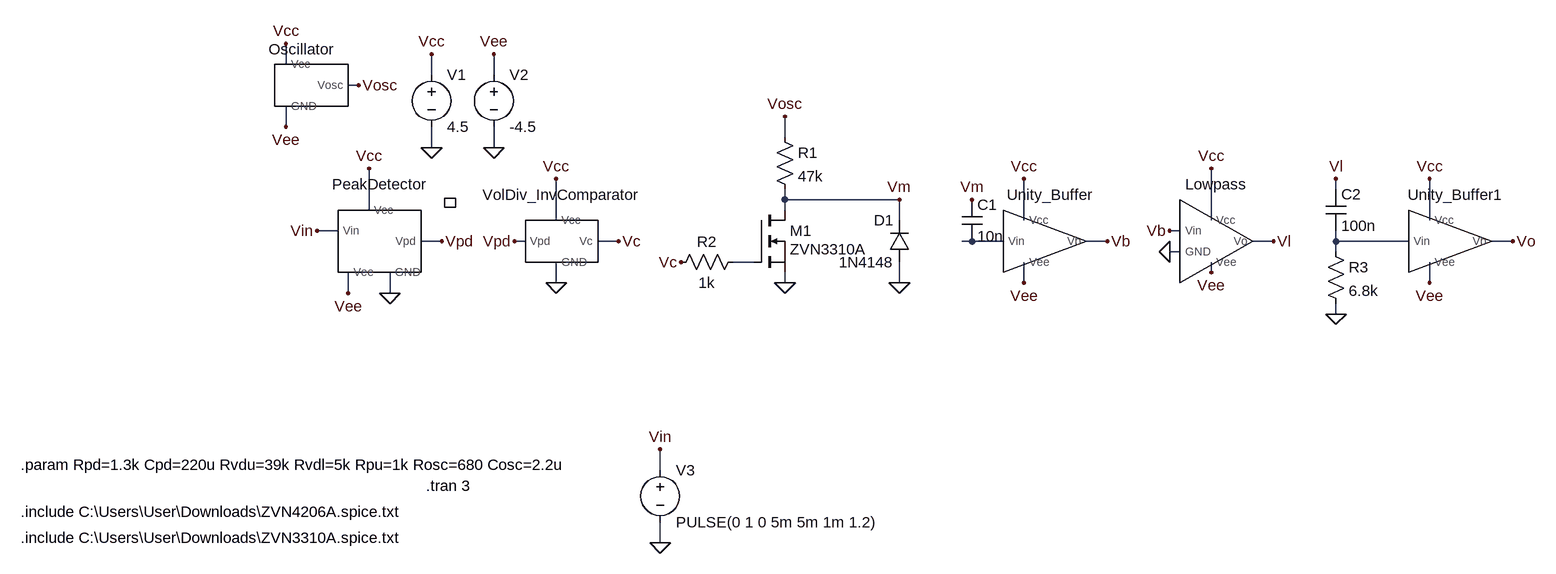
[diagram p0: schematic lab6.asc]
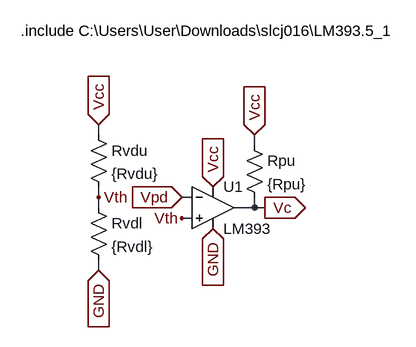
[diagram p1: sub-circuit voldiv_invcomp.asc]
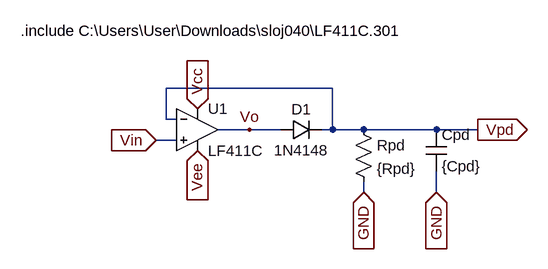
[diagram p2: sub-circuit peak_detector.asc]
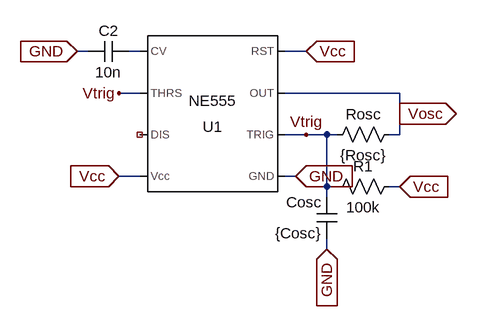
[diagram p3: sub-circuit oscillator.asc]
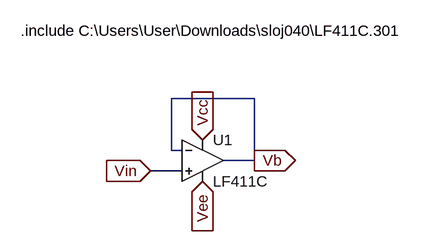
[diagram p4: sub-circuit unity_buffer.asc]
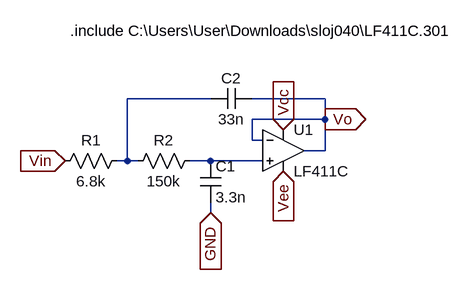
[diagram p5: sub-circuit lowpass.asc]
lab6.asc, the LTspice schematic file:
Version 4
SHEET 1 1960 692
WIRE -48 -96 -48 -128
WIRE 176 -80 176 -112
WIRE 272 -80 272 -112
WIRE 64 -64 48 -64
WIRE -48 0 -48 -32
WIRE 720 16 720 -16
WIRE 176 32 176 0
WIRE 272 32 272 0
WIRE 1568 96 1568 80
WIRE 720 112 720 96
WIRE 896 112 720 112
WIRE 80 128 80 64
WIRE 720 128 720 112
WIRE 368 144 368 80
WIRE 896 144 896 112
WIRE 1088 144 1088 80
WIRE 1376 144 1376 64
WIRE 1712 144 1712 80
WIRE 32 160 0 160
WIRE 1328 160 1312 160
WIRE 192 176 160 176
WIRE 320 176 304 176
WIRE 464 176 432 176
WIRE 1008 176 992 176
WIRE 1056 176 1008 176
WIRE 1216 176 1184 176
WIRE 1472 176 1440 176
WIRE 1568 176 1568 160
WIRE 1680 176 1568 176
WIRE 1840 176 1808 176
WIRE 1328 192 1312 192
WIRE 1568 192 1568 176
WIRE 672 208 640 208
WIRE 1376 224 1376 208
WIRE 368 240 368 208
WIRE 720 240 720 224
WIRE 896 240 896 208
WIRE 1088 240 1088 208
WIRE 1712 240 1712 208
WIRE 48 256 48 224
WIRE 112 256 112 224
WIRE 1568 288 1568 272
WIRE 528 528 528 496
WIRE 528 640 528 608
FLAG 528 640 0
FLAG 176 32 0
FLAG 272 32 0
FLAG 176 -112 Vcc
FLAG 272 -112 Vee
FLAG 528 496 Vin
FLAG 0 160 Vin
FLAG 192 176 Vpd
FLAG 368 240 0
FLAG 368 80 Vcc
FLAG 304 176 Vpd
FLAG 80 64 Vcc
FLAG 48 256 Vee
FLAG 112 256 0
FLAG -48 -128 Vcc
FLAG 64 -64 Vosc
FLAG 464 176 Vc
FLAG 720 240 0
FLAG 720 -16 Vosc
FLAG 1008 112 Vm
FLAG 1088 80 Vcc
FLAG 1088 240 Vee
FLAG 1216 176 Vb
FLAG 1312 160 Vb
FLAG 1376 64 Vcc
FLAG 1376 224 Vee
FLAG 1312 192 0
FLAG 1472 176 Vl
FLAG 896 240 0
FLAG 896 112 Vm
FLAG -48 0 Vee
FLAG 1568 288 0
FLAG 1568 80 Vl
FLAG 1712 80 Vcc
FLAG 1712 240 Vee
FLAG 1840 176 Vo
FLAG 560 208 Vc
SYMBOL voltage 176 -96 R0
WINDOW 123 0 0 Left 0
WINDOW 39 0 0 Left 0
SYMATTR InstName V1
SYMATTR Value 4.5
SYMBOL voltage 272 -96 R0
WINDOW 123 0 0 Left 0
WINDOW 39 0 0 Left 0
SYMATTR InstName V2
SYMATTR Value -4.5
SYMBOL voltage 528 512 R0
WINDOW 123 0 0 Left 0
WINDOW 39 0 0 Left 0
SYMATTR InstName V3
SYMATTR Value PULSE(0 1 0 5m 5m 1m 1.2)
SYMBOL VolDiv_InvComp 368 176 R0
SYMATTR InstName VolDiv_InvComparator
SYMBOL peak_detector 96 176 R0
SYMATTR InstName PeakDetector
SYMBOL oscillator -32 -64 R0
SYMATTR InstName Oscillator
SYMBOL nmos 672 128 R0
WINDOW 3 56 60 Left 2
SYMATTR Value ZVN3310A
SYMATTR InstName M1
SYMATTR Prefix X
SYMBOL res 704 0 R0
SYMATTR InstName R1
SYMATTR Value 47k
SYMBOL unity_buffer 1120 176 R0
SYMATTR InstName Unity_Buffer
SYMBOL Lowpass 1376 176 R0
SYMATTR InstName Lowpass
SYMBOL diode 912 208 R180
WINDOW 0 24 64 Left 2
WINDOW 3 24 0 Left 2
SYMATTR InstName D1
SYMATTR Value 1N4148
SYMBOL unity_buffer 1744 176 R0
SYMATTR InstName Unity_Buffer1
SYMBOL cap 1552 96 R0
SYMATTR InstName C2
SYMATTR Value 100n
SYMBOL res 1552 176 R0
SYMATTR InstName R3
SYMATTR Value 6.8k
SYMBOL res 656 192 R90
WINDOW 0 0 56 VBottom 2
WINDOW 3 32 56 VTop 2
SYMATTR InstName R2
SYMATTR Value 1k
SYMBOL cap 992 112 R0
SYMATTR InstName C1
SYMATTR Value 10n
TEXT -456 520 Left 2 !.param Rpd=1.3k Cpd=220u Rvdu=39k Rvdl=5k Rpu=1k Rosc=680 Cosc=2.2u
TEXT 168 552 Left 2 !.tran 3
TEXT -456 592 Left 2 !.include C:\\Users\\User\\Downloads\\ZVN4206A.spice.txt
TEXT -456 632 Left 2 !.include C:\\Users\\User\\Downloads\\ZVN3310A.spice.txt

voldiv_invcomp.asc, the sub-circuit schematic file:
Version 4
SHEET 1 880 680
WIRE -48 96 -48 80
WIRE 192 112 192 96
WIRE -48 192 -48 176
WIRE 96 192 80 192
WIRE -48 208 -48 192
WIRE 192 208 192 192
WIRE 192 208 160 208
WIRE 208 208 192 208
WIRE 96 224 80 224
WIRE -48 304 -48 288
FLAG 128 240 GND
IOPIN 128 240 In
FLAG 128 176 Vcc
IOPIN 128 176 In
FLAG 80 192 Vpd
IOPIN 80 192 In
FLAG 80 224 Vth
FLAG 208 208 Vc
IOPIN 208 208 Out
FLAG -48 304 GND
IOPIN -48 304 In
FLAG -48 80 Vcc
IOPIN -48 80 In
FLAG -48 192 Vth
FLAG 192 96 Vcc
IOPIN 192 96 In
SYMBOL OpAmps\\opamp2 128 144 R0
SYMATTR InstName U1
SYMATTR Value LM393
SYMBOL res -64 192 R0
SYMATTR InstName Rvdl
SYMATTR Value {Rvdl}
SYMBOL res -64 80 R0
SYMATTR InstName Rvdu
SYMATTR Value {Rvdu}
SYMBOL res 176 96 R0
SYMATTR InstName Rpu
SYMATTR Value {Rpu}
TEXT -168 -64 Left 2 !.include C:\\Users\\User\\Downloads\\slcj016\\LM393.5_1

peak_detector.asc, the sub-circuit schematic file:
Version 4
SHEET 1 2072 680
WIRE 336 0 80 0
WIRE 80 48 80 0
WIRE 96 48 80 48
WIRE 208 64 160 64
WIRE 256 64 208 64
WIRE 336 64 336 0
WIRE 336 64 320 64
WIRE 384 64 336 64
WIRE 496 64 384 64
WIRE 560 64 496 64
WIRE 96 80 64 80
WIRE 384 160 384 144
WIRE 496 160 496 128
FLAG 208 64 Vo
FLAG 64 80 Vin
IOPIN 64 80 In
FLAG 128 32 Vcc
IOPIN 128 32 In
FLAG 128 96 Vee
IOPIN 128 96 In
FLAG 560 64 Vpd
IOPIN 560 64 Out
FLAG 384 160 GND
IOPIN 384 160 In
FLAG 496 160 GND
IOPIN 496 160 In
SYMBOL diode 256 80 R270
WINDOW 0 32 32 VTop 2
WINDOW 3 0 32 VBottom 2
SYMATTR InstName D1
SYMATTR Value 1N4148
SYMBOL res 368 48 R0
SYMATTR InstName Rpd
SYMATTR Value {Rpd}
SYMBOL cap 480 64 R0
SYMATTR InstName Cpd
SYMATTR Value {Cpd}
SYMBOL OpAmps\\opamp2 128 0 R0
SYMATTR InstName U1
SYMATTR Value LF411C
TEXT -144 -88 Left 2 !.include C:\\Users\\User\\Downloads\\sloj040\\LF411C.301

oscillator.asc, the sub-circuit schematic file:
Version 4
SHEET 1 880 680
WIRE 64 64 48 64
WIRE 144 64 128 64
WIRE 400 64 368 64
WIRE 144 128 112 128
WIRE 544 128 368 128
WIRE 544 160 544 128
WIRE 400 192 368 192
WIRE 432 192 400 192
WIRE 448 192 432 192
WIRE 544 192 544 160
WIRE 544 192 528 192
WIRE 144 256 112 256
WIRE 384 256 368 256
WIRE 432 272 432 192
WIRE 448 272 432 272
WIRE 544 272 528 272
WIRE 432 288 432 272
WIRE 432 368 432 352
FLAG 400 64 Vcc
IOPIN 400 64 In
FLAG 112 256 Vcc
IOPIN 112 256 In
FLAG 544 160 Vosc
IOPIN 544 160 Out
FLAG 544 272 Vcc
IOPIN 544 272 In
FLAG 400 192 Vtrig
FLAG 384 256 GND
IOPIN 384 256 In
FLAG 432 368 GND
IOPIN 432 368 In
FLAG 112 128 Vtrig
FLAG 48 64 GND
IOPIN 48 64 In
SYMBOL Misc\\NE555 256 160 R180
SYMATTR InstName U1
SYMBOL res 544 256 R90
WINDOW 0 0 56 VBottom 2
WINDOW 3 32 56 VTop 2
SYMATTR InstName R1
SYMATTR Value 100k
SYMBOL res 544 176 R90
WINDOW 0 0 56 VBottom 2
WINDOW 3 32 56 VTop 2
SYMATTR InstName Rosc
SYMATTR Value {Rosc}
SYMBOL cap 448 352 R180
WINDOW 0 24 56 Left 2
WINDOW 3 24 8 Left 2
SYMATTR InstName Cosc
SYMATTR Value {Cosc}
SYMBOL cap 128 48 R90
WINDOW 0 0 32 VBottom 2
WINDOW 3 32 32 VTop 2
SYMATTR InstName C2
SYMATTR Value 10n

unity_buffer.asc, the sub-circuit schematic file:
Version 4
SHEET 1 880 680
WIRE 256 80 128 80
WIRE 128 160 128 80
WIRE 144 160 128 160
WIRE 256 176 256 80
WIRE 256 176 208 176
WIRE 144 192 96 192
FLAG 176 144 Vcc
IOPIN 176 144 In
FLAG 176 208 Vee
IOPIN 176 208 In
FLAG 96 192 Vin
IOPIN 96 192 In
FLAG 256 176 Vb
IOPIN 256 176 Out
SYMBOL OpAmps\\opamp2 176 112 R0
SYMATTR InstName U1
SYMATTR Value LF411C
TEXT -104 -24 Left 2 !.include C:\\Users\\User\\Downloads\\sloj040\\LF411C.301

lowpass.asc, the sub-circuit schematic file:
Version 4
SHEET 1 880 680
WIRE 144 64 16 64
WIRE 320 64 208 64
WIRE 320 96 320 64
WIRE 320 96 208 96
WIRE 208 128 208 96
WIRE 224 128 208 128
WIRE 320 144 320 96
WIRE 320 144 288 144
WIRE 16 160 16 64
WIRE 16 160 0 160
WIRE 32 160 16 160
WIRE 144 160 112 160
WIRE 224 160 144 160
WIRE 144 240 144 224
FLAG -80 160 Vin
IOPIN -80 160 In
FLAG 256 112 Vcc
IOPIN 256 112 In
FLAG 256 176 Vee
IOPIN 256 176 In
FLAG 320 96 Vo
IOPIN 320 96 Out
FLAG 144 240 GND
IOPIN 144 240 In
SYMBOL res 16 144 R90
WINDOW 0 0 56 VBottom 2
WINDOW 3 32 56 VTop 2
SYMATTR InstName R1
SYMATTR Value 6.8k
SYMBOL res 128 144 R90
WINDOW 0 0 56 VBottom 2
WINDOW 3 32 56 VTop 2
SYMATTR InstName R2
SYMATTR Value 150k
SYMBOL cap 128 160 R0
SYMATTR InstName C1
SYMATTR Value 3.3n
SYMBOL cap 208 48 R90
WINDOW 0 0 32 VBottom 2
WINDOW 3 32 32 VTop 2
SYMATTR InstName C2
SYMATTR Value 33n
SYMBOL OpAmps\\opamp2 256 80 R0
SYMATTR InstName U1
SYMATTR Value LF411C
TEXT -72 -40 Left 2 !.include C:\\Users\\User\\Downloads\\sloj040\\LF411C.301

The netlist it stands for:
* lab6.asc
V1 Vcc 0 4.5
V2 Vee 0 -4.5
V3 Vin 0 PULSE(0 1 0 5m 5m 1m 1.2)
XVolDiv_InvComparator 0 Vcc Vpd Vc voldiv_invcomp
XPeakDetector 0 Vcc Vee Vin Vpd peak_detector
XOscillator Vee Vcc Vosc oscillator
XM1 Vm N003 0 ZVN3310A  ; pins D G S
R1 Vosc Vm 47k
XUnity_Buffer Vcc Vee N001 Vb unity_buffer
XLowpass 0 Vcc Vee Vb Vl lowpass
D1 0 Vm 1N4148
XUnity_Buffer1 Vcc Vee N002 Vo unity_buffer
C2 Vl N002 100n
R3 N002 0 6.8k
R2 N003 Vc 1k
C1 Vm N001 10n

* block symbol definitions
.subckt voldiv_invcomp GND Vcc Vpd Vc
XU1 Vth Vpd Vcc GND Vc LM393  ; pins In+ In- V+ V- OUT
Rvdl Vth GND {Rvdl}
Rvdu Vcc Vth {Rvdu}
Rpu Vcc Vc {Rpu}
.include C:\Users\User\Downloads\slcj016\LM393.5_1
.ends voldiv_invcomp

.subckt peak_detector GND Vcc Vee Vin Vpd
D1 Vo Vpd 1N4148
Rpd Vpd GND {Rpd}
Cpd Vpd GND {Cpd}
XU1 Vin Vpd Vcc Vee Vo LF411C  ; pins In+ In- V+ V- OUT
.include C:\Users\User\Downloads\sloj040\LF411C.301
.ends peak_detector

.subckt oscillator GND Vcc Vosc
XU1 GND Vtrig Vosc Vcc N001 Vtrig NC_01 Vcc NE555  ; pins GND TRIG OUT RST CV THRS DIS Vcc
R1 Vcc Vtrig 100k
Rosc Vosc Vtrig {Rosc}
Cosc GND Vtrig {Cosc}
C2 N001 GND 10n
.ends oscillator

.subckt unity_buffer Vcc Vee Vin Vb
XU1 Vin Vb Vcc Vee Vb LF411C  ; pins In+ In- V+ V- OUT
.include C:\Users\User\Downloads\sloj040\LF411C.301
.ends unity_buffer

.subckt lowpass GND Vcc Vee Vin Vo
R1 N001 Vin 6.8k
R2 N002 N001 150k
C1 N002 GND 3.3n
C2 Vo N001 33n
XU1 N002 Vo Vcc Vee Vo LF411C  ; pins In+ In- V+ V- OUT
.include C:\Users\User\Downloads\sloj040\LF411C.301
.ends lowpass

.model D D
.lib standard.dio
.param Rpd=1.3k Cpd=220u Rvdu=39k Rvdl=5k Rpu=1k Rosc=680 Cosc=2.2u
.tran 3
.include C:\Users\User\Downloads\ZVN4206A.spice.txt
.include C:\Users\User\Downloads\ZVN3310A.spice.txt
.lib NE555.sub
.backanno
.end